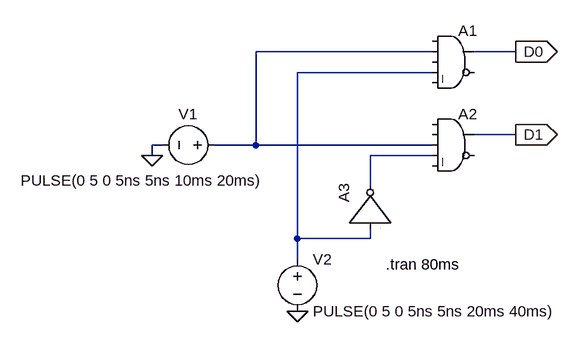
[diagram p0: schematic demux.asc]
demux.asc, the LTspice schematic file:
Version 4
SHEET 1 880 680
WIRE 208 80 -64 80
WIRE 336 80 272 80
WIRE 208 112 0 112
WIRE 336 208 272 208
WIRE -208 224 -224 224
WIRE -64 224 -64 80
WIRE -64 224 -128 224
WIRE 208 224 -64 224
WIRE -224 240 -224 224
WIRE 208 240 112 240
WIRE 112 288 112 240
WIRE 0 368 0 112
WIRE 112 368 112 352
WIRE 112 368 0 368
WIRE 0 400 0 368
FLAG -224 240 0
FLAG 0 480 0
FLAG 336 80 D0
IOPIN 336 80 Out
FLAG 336 208 D1
IOPIN 336 208 Out
SYMBOL Digital\\and 240 32 R0
SYMATTR InstName A1
SYMBOL Digital\\and 240 160 R0
SYMATTR InstName A2
SYMBOL Digital\\inv 48 352 R270
SYMATTR InstName A3
SYMBOL voltage -112 224 R90
WINDOW 0 -32 56 VBottom 2
WINDOW 3 39 128 VTop 2
WINDOW 123 0 0 Left 0
WINDOW 39 0 0 Left 0
SYMATTR InstName V1
SYMATTR Value PULSE(0 5 0 5ns 5ns 10ms 20ms)
SYMBOL voltage 0 384 R0
WINDOW 123 0 0 Left 0
WINDOW 39 0 0 Left 0
SYMATTR InstName V2
SYMATTR Value PULSE(0 5 0 5ns 5ns 20ms 40ms)
TEXT 136 408 Left 2 !.tran 80ms

The netlist it stands for:
* demux.asc
A1 0 N001 0 N002 0 0 D0 0 AND
A2 0 0 N001 N003 0 0 D1 0 AND
A3 N002 0 0 0 0 N003 0 0 BUF
V1 N001 0 PULSE(0 5 0 5ns 5ns 10ms 20ms)
V2 N002 0 PULSE(0 5 0 5ns 5ns 20ms 40ms)
.tran 80ms
.backanno
.end